# Altium schematic sheet Interface.SchDoc
size A; SheetNumber: 1; SheetTotal: 5
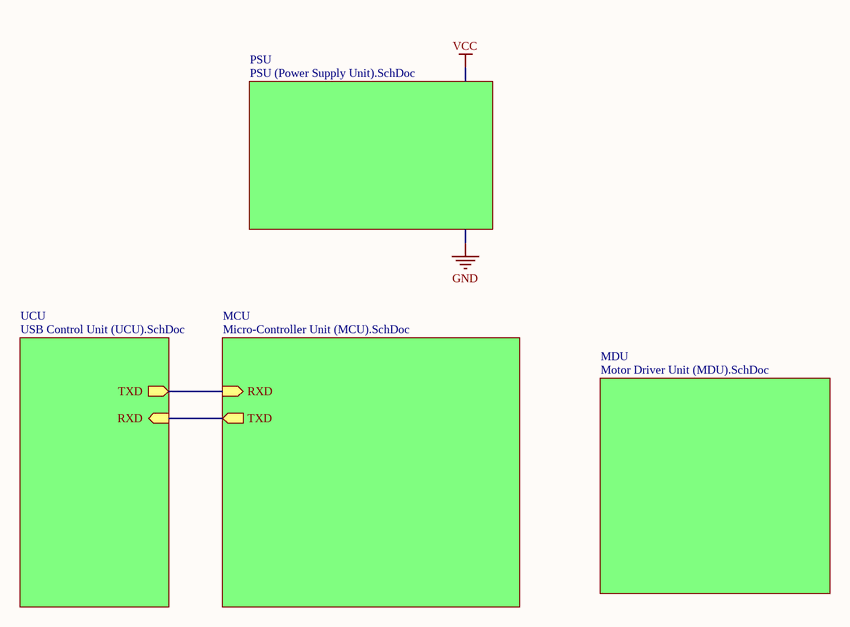
[diagram p0: Interface.SchDoc]

## Sub-sheets
MCU = Micro-Controller Unit (MCU).SchDoc: RXD (in), TXD (out)
MDU = Motor Driver Unit (MDU).SchDoc: no entries
PSU = PSU (Power Supply Unit).SchDoc: no entries
UCU = USB Control Unit (UCU).SchDoc: TXD (out), RXD (in)

## Nets
(unnamed): sheet UCU/TXD, sheet MCU/RXD
(unnamed): sheet UCU/RXD, sheet MCU/TXD